# Altium schematic sheet Periph_SCH.SchDoc
size A
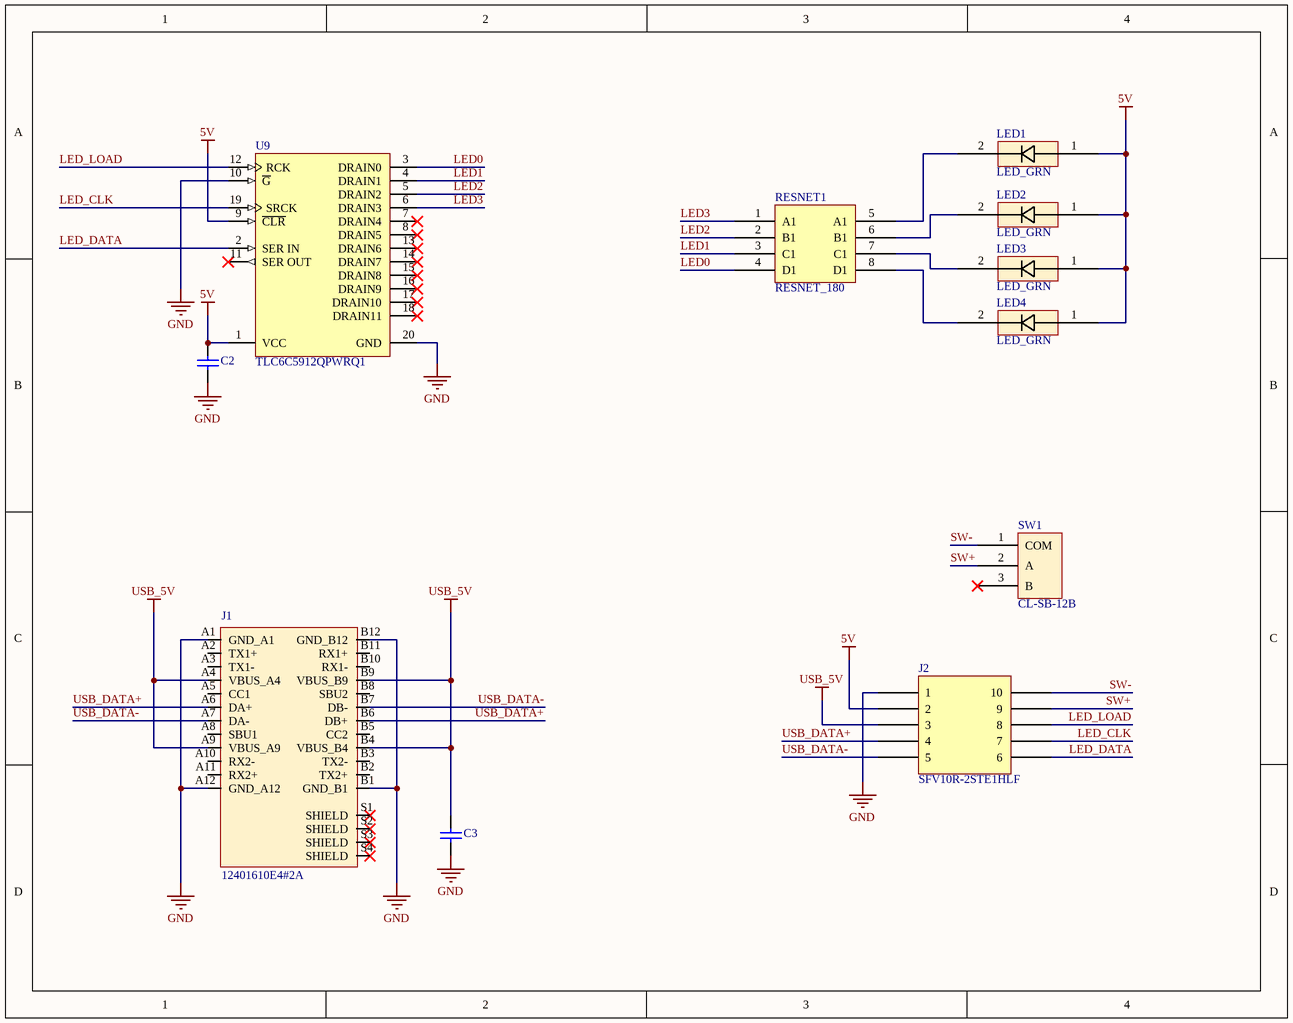
[diagram p0: Periph_SCH.SchDoc]

## Parts
C2  08055C104KAJ2A  [CAPC2013X140X50NL20T25]  (value not drawn)
C3  08055C104KAJ2A  [CAPC2013X140X50NL20T25]  (value not drawn)
J1  12401610E4#2A  [AMPHENOL_12401610E4_2A_12401610E4]
J2  SFV10R-2STE1HLF  [SVF10R-2STE1HLF]
LED1  LED_GRN  [DIOC3212X08N]
LED2  LED_GRN  [DIOC3212X08N]
LED3  LED_GRN  [DIOC3212X08N]
LED4  LED_GRN  [DIOC3212X08N]
RESNET1  RESNET_180  [CAC-80P320X165-8N]
SW1  CL-SB-12B  [CL-SB-12B]
U9  TLC6C5912QPWRQ1  [PW0020A_N]

## Nets
5V: C2.2 J2.2 LED1.1(Anode) LED2.1(Anode) LED3.1(Anode) LED4.1(Anode) U9.1(VCC) U9.9(~{CLR})
GND: C2.1 C3.1 J1.A1(GND_A1) J1.A12(GND_A12) J1.B1(GND_B1) J1.B12(GND_B12) J2.1 U9.10(~{G}) U9.20(GND)
USB_5V: C3.2 J1.A4(VBUS_A4) J1.A9(VBUS_A9) J1.B4(VBUS_B4) J1.B9(VBUS_B9) J2.3
LED0: RESNET1.4(D1) U9.3(DRAIN0)
LED1: RESNET1.3(C1) U9.4(DRAIN1)
LED2: RESNET1.2(B1) U9.5(DRAIN2)
LED3: RESNET1.1(A1) U9.6(DRAIN3)
LED_CLK: J2.7 U9.19(SRCK)
LED_DATA: J2.6 U9.2(SER_IN)
LED_LOAD: J2.8 U9.12(RCK)
SW+: J2.9 SW1.2(A)
SW-: J2.10 SW1.1(COM)
USB_DATA+: J1.A6(DA+) J1.B6(DB+) J2.4
USB_DATA-: J1.A7(DA-) J1.B7(DB-) J2.5
NetLED1_2: LED1.2(Cathode) RESNET1.5(A1)
NetLED2_2: LED2.2(Cathode) RESNET1.6(B1)
NetLED3_2: LED3.2(Cathode) RESNET1.7(C1)
NetLED4_2: LED4.2(Cathode) RESNET1.8(D1)

Not connected (* = marked no-connect by the designer): J1 A2(TX1+) A3(TX1-) A5(CC1) A8(SBU1) A10(RX2-) A11(RX2+) B2(TX2+) B3(TX2-) B5(CC2) B8(SBU2) B10(RX1-) B11(RX1+) S1(SHIELD)* S2(SHIELD)* S3(SHIELD)* S4(SHIELD)*; SW1 3(B)*; U9 7(DRAIN4)* 8(DRAIN5)* 11(SER_OUT)* 13(DRAIN6)* 14(DRAIN7)* 15(DRAIN8)* 16(DRAIN9)* 17(DRAIN10)* 18(DRAIN11)*

## Library data of the parts
C2 C3 = CMP-2007-04765-1: Manufacturer: AVX Interconnect / Elco; Part Number: 08055C104KAJ2A
J1 = 12401610E4#2A: Conn USB Type C Surface Mount Receptacle; MF: Amphenol ICC; Digi-Key_Purchase_URL: https://www.digikey.com/product-detail/en/amphenol-icc-commercial-products/12401610E4-2A/12401610E4-2ACT-ND/5775520?utm_source=snapeda&utm_medium=aggregator&utm_campaign=symbol; Digi-Key_Part_Number: 12401610E4#2ACT-ND; Package: None; SnapEDA_Link: https://www.snapeda.com/parts/12401610E4%232A/Amphenol%20ICC/view-part/?ref=snap; MP: 12401610E4#2A; Value: *
RESNET1 = RESNET_180: RES ARRAY 4 RES 180 OHM 2012; ComponentLink1Description: DigiKey; ComponentLink1URL: https://www.digikey.com/product-detail/en/cts-resistor-products/744C083681JP/744C083681JPCT-ND/
U9 = CMP-1582-00026-1: Automotive Power Logic 12-Bit Shift Register LED Driver, PW0020A, LARGE T&R; Part Number: TLC6C5912-Q1; rDS(on)(Ohms): 7.4; tPLH(ns): 210; IO(CONT)(A): 0.05; ICC(uA): 130; VDS(Max)(V): 40; ComponentLink2URL: http://www.ti.com/lit/ds/symlink/tlc6c5912-q1.pdf; ComponentLink1Description: Manufacturer URL; ComponentLink1URL: http://www.ti.com/; Rating: Automotive; Operating Temperature Range(C): -40 to 125; ComponentLink2Description: Datasheet; PackageReference: PW0020A; PartNumber: TLC6C5912QPWRQ1; DatasheetVersion: SLIS141A